# Altium schematic sheet main_8.SchDoc: main
size 282 x 273 mm; Date: 9/25/2019 7:26:22 PM; SheetNumber: 9; CNAME: RJ Cunningham; GateName_1: G$1; SymbolName_1: A4L-LOC; LibraryName: frames; DeviceSetName: A4L-LOC
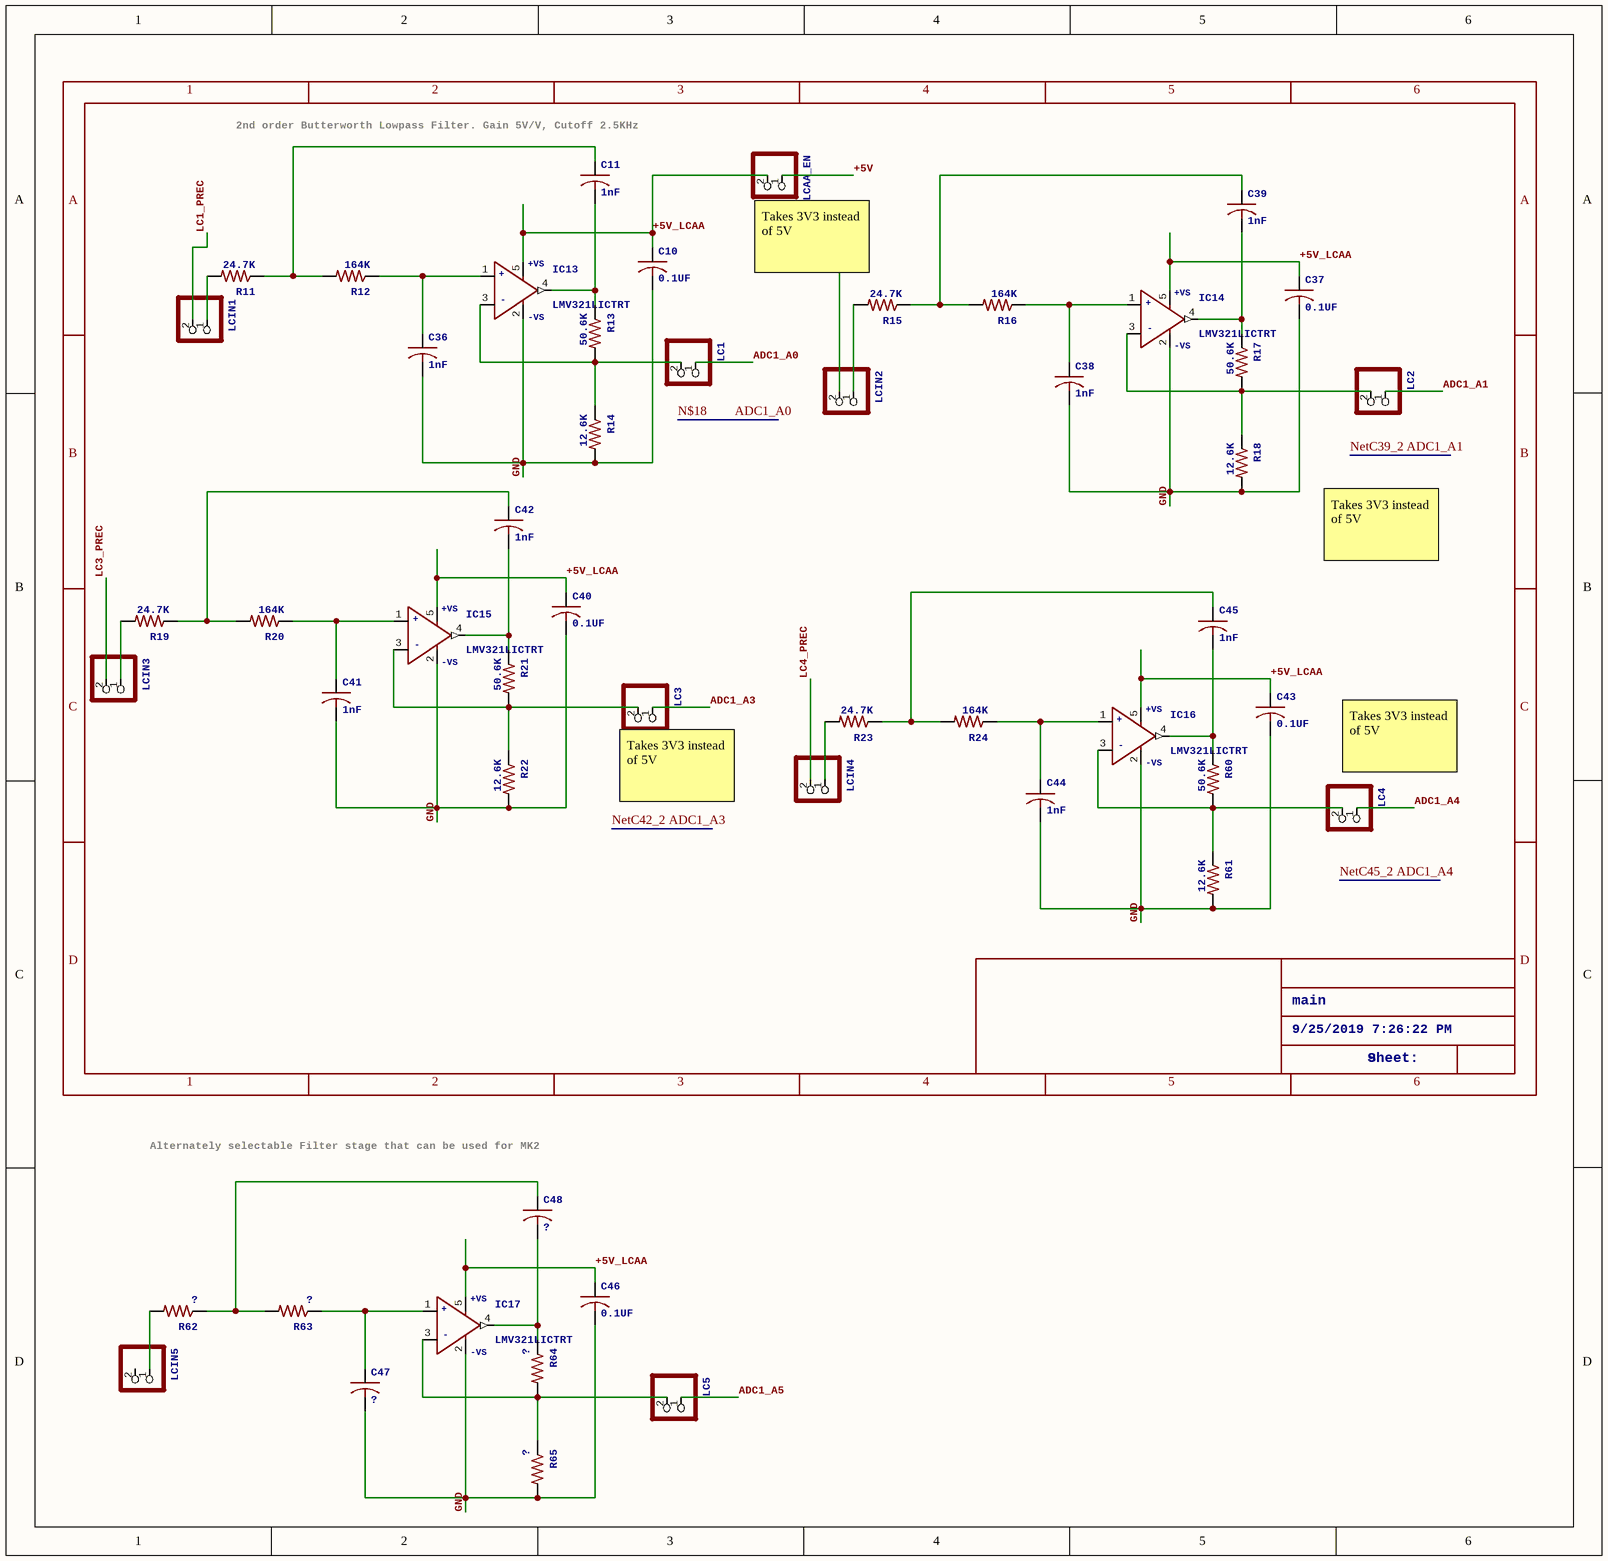
[diagram p0: main_8.SchDoc]

## Parts
C10  0.1UF  [C0805]
C11  1nF  [C0805]
C36  1nF  [C0805]
C37  0.1UF  [C0805]
C38  1nF  [C0805]
C39  1nF  [C0805]
C40  0.1UF  [C0805]
C41  1nF  [C0805]
C42  1nF  [C0805]
C43  0.1UF  [C0805]
C44  1nF  [C0805]
C45  1nF  [C0805]
C46  0.1UF  [C0805]
C47  ?  [C0805]
C48  ?  [C0805]
IC13  LMV321LICTRT  [SOT23-5]
IC14  LMV321LICTRT  [SOT23-5]
IC15  LMV321LICTRT  [SOT23-5]
IC16  LMV321LICTRT  [SOT23-5]
IC17  LMV321LICTRT  [SOT23-5]
LC1  PINHD-1X2  [1X02]  (value not drawn)
LC2  PINHD-1X2  [1X02]  (value not drawn)
LC3  PINHD-1X2  [1X02]  (value not drawn)
LC4  PINHD-1X2  [1X02]  (value not drawn)
LC5  PINHD-1X2  [1X02]  (value not drawn)
LCAA_EN  PINHD-1X2  [1X02]  (value not drawn)
LCIN1  PINHD-1X2  [1X02]  (value not drawn)
LCIN2  PINHD-1X2  [1X02]  (value not drawn)
LCIN3  PINHD-1X2  [1X02]  (value not drawn)
LCIN4  PINHD-1X2  [1X02]  (value not drawn)
LCIN5  PINHD-1X2  [1X02]  (value not drawn)
R11  24.7K  [R0805]
R12  164K  [R0805]
R13  50.6K  [R0805]
R14  12.6K  [R0805]
R15  24.7K  [R0805]
R16  164K  [R0805]
R17  50.6K  [R0805]
R18  12.6K  [R0805]
R19  24.7K  [R0805]
R20  164K  [R0805]
R21  50.6K  [R0805]
R22  12.6K  [R0805]
R23  24.7K  [R0805]
R24  164K  [R0805]
R60  50.6K  [R0805]
R61  12.6K  [R0805]
R62  ?  [R0805]
R63  ?  [R0805]
R64  ?  [R0805]
R65  ?  [R0805]

## Nets
+5V: LCAA_EN.1
+5V_LCAA: C10.1 C37.1 C40.1 C43.1 C46.1 IC13.5(+VS) IC14.5(+VS) IC15.5(+VS) IC16.5(+VS) IC17.5(+VS) LCAA_EN.2
ADC1_A0: LC1.1  [also labelled N$18]
ADC1_A1: LC2.1  [also labelled NetC39_2]
ADC1_A3: LC3.1  [also labelled NetC42_2]
ADC1_A4: LC4.1  [also labelled NetC45_2]
ADC1_A5: LC5.1
GND: C10.2 C36.2 C37.2 C38.2 C40.2 C41.2 C43.2 C44.2 C46.2 C47.2 IC13.2(-VS) IC14.2(-VS) IC15.2(-VS) IC16.2(-VS) IC17.2(-VS) R14.2 R18.2 R22.2 R61.2 R65.2
LC1_PREC: LCIN1.2
LC2_PREC: LCIN2.2
LC3_PREC: LCIN3.2
LC4_PREC: LCIN4.2
NetC11_1: C11.1 R11.1 R12.2
NetC11_2: C11.2 IC13.4(OUT) R13.1
NetC36_1: C36.1 IC13.1(IN+) R12.1
NetC38_1: C38.1 IC14.1(IN+) R16.1
NetC39_1: C39.1 R15.1 R16.2
NetC39_2: C39.2 IC14.4(OUT) R17.1
NetC41_1: C41.1 IC15.1(IN+) R20.1
NetC42_1: C42.1 R19.1 R20.2
NetC42_2: C42.2 IC15.4(OUT) R21.1
NetC44_1: C44.1 IC16.1(IN+) R24.1
NetC45_1: C45.1 R23.1 R24.2
NetC45_2: C45.2 IC16.4(OUT) R60.1
NetC47_1: C47.1 IC17.1(IN+) R63.1
NetC48_1: C48.1 R62.1 R63.2
NetC48_2: C48.2 IC17.4(OUT) R64.1
NetIC13_3: IC13.3(IN-) LC1.2 R13.2 R14.1
NetIC14_3: IC14.3(IN-) LC2.2 R17.2 R18.1
NetIC15_3: IC15.3(IN-) LC3.2 R21.2 R22.1
NetIC16_3: IC16.3(IN-) LC4.2 R60.2 R61.1
NetIC17_3: IC17.3(IN-) LC5.2 R64.2 R65.1
NetLCIN1_1: LCIN1.1 R11.2
NetLCIN2_1: LCIN2.1 R15.2
NetLCIN3_1: LCIN3.1 R19.2
NetLCIN4_1: LCIN4.1 R23.2
NetLCIN5_1: LCIN5.1 R62.2

Not connected (* = marked no-connect by the designer): LCIN5 2

## Notes on the sheet
- 2nd order Butterworth Lowpass Filter. Gain 5V/V, Cutoff 2.5KHz
- (near LCAA_EN) Takes 3V3 instead of 5V
- Takes 3V3 instead of 5V
- (near LC3) Takes 3V3 instead of 5V
- main
- 9/25/2019 7:26:22 PM
- 9
- Sheet:
- Alternately selectable Filter stage that can be used for MK2
- 1
- 2
- 3
- 4
- 5
- 6
- A
- B
- C
- D

## Library data of the parts
C10 C11 C36-C48 = C-USC0805: CAPACITOR, American symbol; GateName_1: G$1; SymbolName_1: C-US; DeviceName: C0805; LibraryName: rcl; DeviceSetName: C-US; SPICEPREFIX: C
IC13-IC17 = LMV321LICTRT: High Performance, 145 MHz FastFET Op AmpsSource: http://www.analog.com/static/imported-files/data_sheets/AD8065_8066.pdf; MPN: AD8065ARTZ-REEL7; GateName_1: G$; SymbolName_1: OP+-VS; DeviceName: RT; MF: ALTERA CORPORATION; LibraryName: st-microelectronics-extra; DeviceSetName: LMV321LICT; OC_FARNELL: 1464845; OC_NEWARK: 59K6316; +: +; -: -; +VS: +VS; -VS: -VS
LC1-LC5 LCAA_EN LCIN1-LCIN5 = PINHD-1X2: PIN HEADER; GateName_1: G$1; SymbolName_1: PINHD2; LibraryName: pinhead; DeviceSetName: PINHD-1X2
R11-R24 R60-R65 = R-US_R0805: RESISTOR, American symbol; GateName_1: G$1; SymbolName_1: R-US; DeviceSetName: R-US_; DeviceName: R0805; LibraryName: rcl